# Altium schematic sheet 故指测试架接口板.SchDoc
size A4 portrait
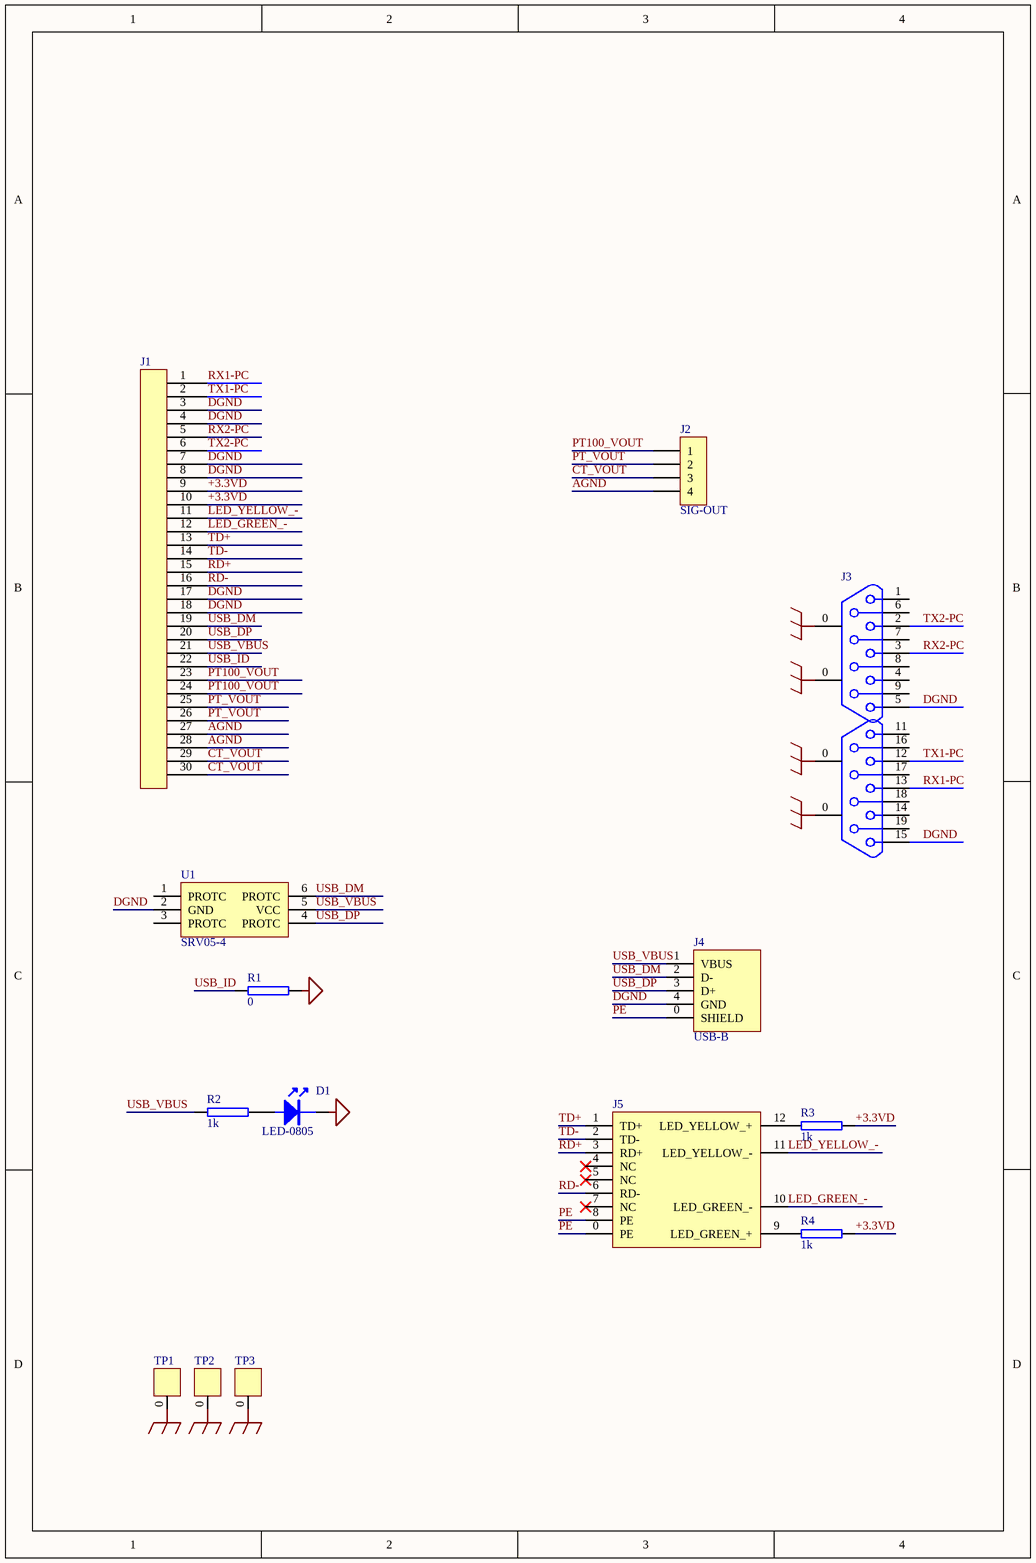
[diagram p0: 故指测试架接口板.SchDoc]

## Parts
D1  LED-0805  [LED-0805]
J1  (no value)  [IDC-30]
J2  SIG-OUT  [KF2EDG3.81]
J3  (no value)  [DB9-2F]
J4  USB-B  [USB-B]
J5  (no value)  [HR911105A]
R1  0  [0805]
R2  1k  [0805]
R3  1k  [0805]
R4  1k  [0805]
TP1  (no value)  [PAD4.5]
TP2  (no value)  [PAD4.5]
TP3  (no value)  [PAD4.5]
U1  SRV05-4  [SOT23-6]

## Nets
DGND: D1.2(K) J1.3 J1.4 J1.7 J1.8 J1.17 J1.18 J3.5 J3.15 J4.4(GND) R1.1 U1.2(GND)
PE: J3.0 J4.0(SHIELD) J5.0(PE) J5.8(PE) TP1.0 TP2.0 TP3.0
+3.3VD: J1.9 J1.10 R3.2 R4.2
AGND: J1.27 J1.28 J2.4
CT_VOUT: J1.29 J1.30 J2.3
LED_GREEN_-: J1.12 J5.10(LED_GREEN_-)
LED_YELLOW_-: J1.11 J5.11(LED_YELLOW_-)
PT100_VOUT: J1.23 J1.24 J2.1
PT_VOUT: J1.25 J1.26 J2.2
RD+: J1.15 J5.3(RD+)
RD-: J1.16 J5.6(RD-)
RX1-PC: J1.1 J3.13
RX2-PC: J1.5 J3.3
TD+: J1.13 J5.1(TD+)
TD-: J1.14 J5.2(TD-)
TX1-PC: J1.2 J3.12
TX2-PC: J1.6 J3.2
USB_DM: J1.19 J4.2(D-) U1.6(PROTC)
USB_DP: J1.20 J4.3(D+) U1.4(PROTC)
USB_ID: J1.22 R1.2
USB_VBUS: J1.21 J4.1(VBUS) R2.1 U1.5(VCC)
NetD1_1: D1.1(A) R2.2
NetJ5_9: J5.9(LED_GREEN_+) R4.1
NetJ5_12: J5.12(LED_YELLOW_+) R3.1

Not connected (* = marked no-connect by the designer): J3 1 4 6 7 8 9 11 14 16 17 18 19; J5 4(NC)* 5(NC)* 7(NC)*; U1 1(PROTC) 3(PROTC)

## Notes on the sheet
- Title
- Size:
- Date:
- A4
- Number:
- Time:
- Revision:
- Sheet
- of
- File:

## Library data of the parts
J1 = CON30
J2 = CON4: Connector
J3 = DB9-2F
J5 = HR911105A
R1-R4 = R
TP1-TP3 = TESTPT